# EAGLE design powersystem (EAGLE 8.3.2)
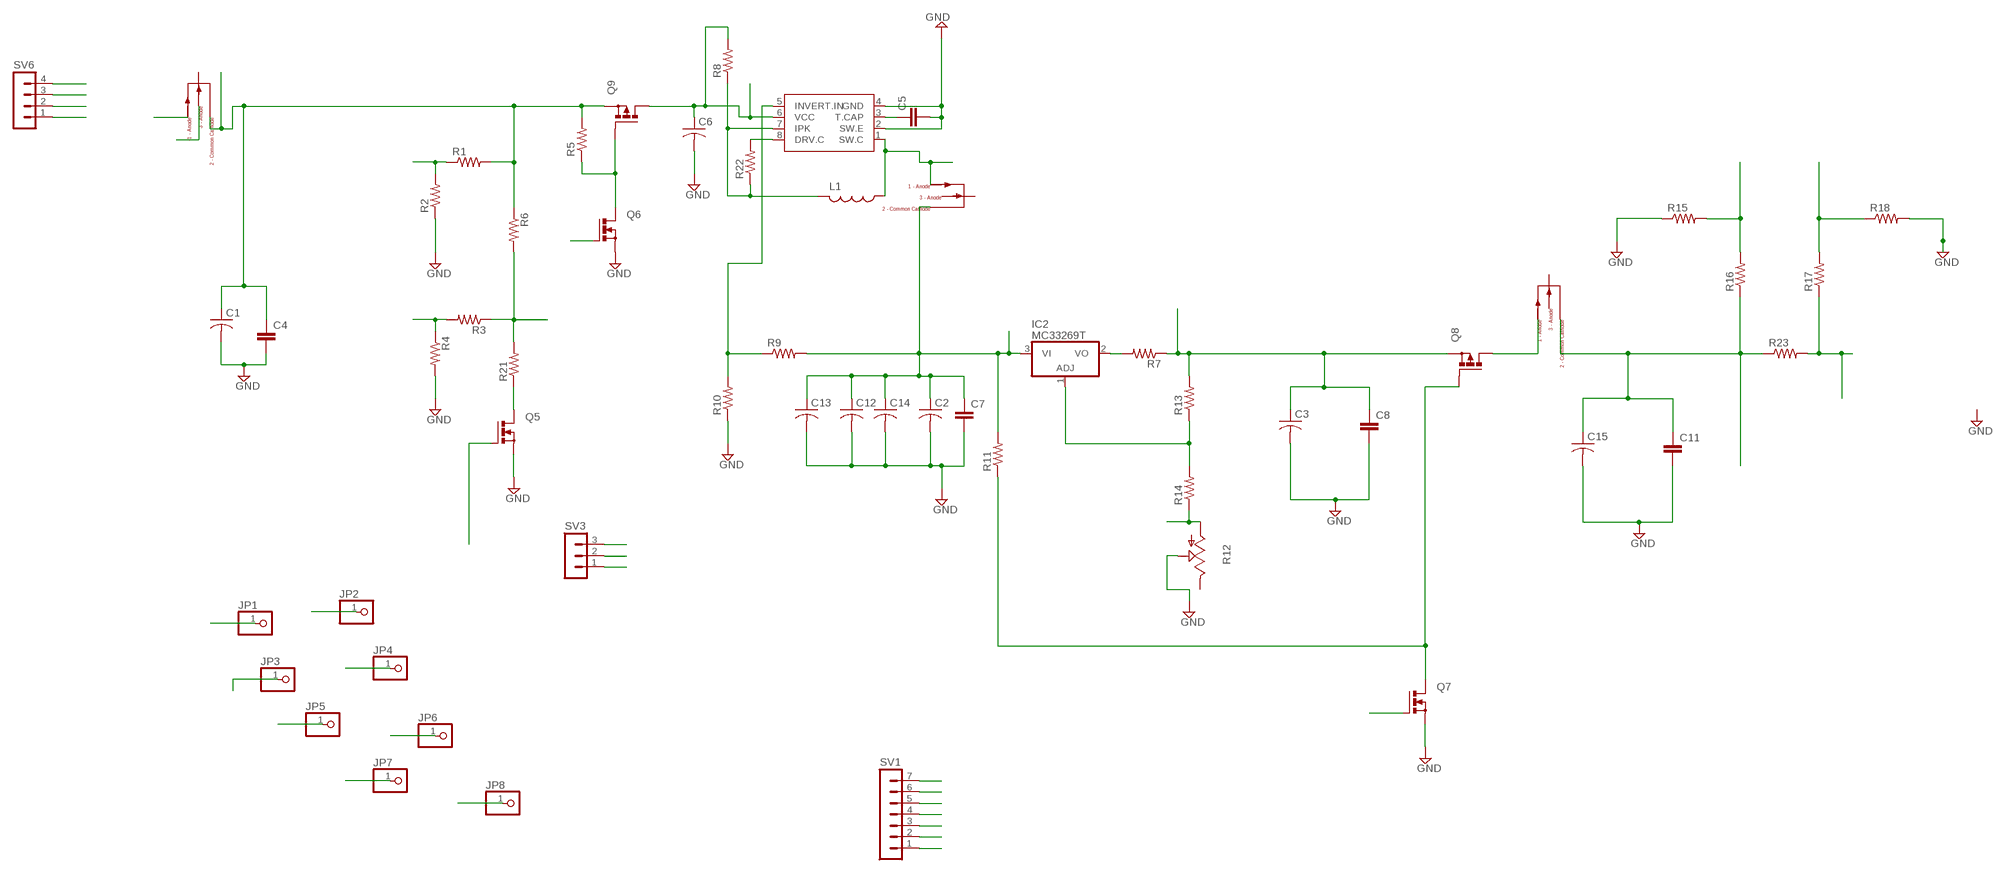
[diagram p0: schematic, sheet 1]

## Parts
C1  C-US025-024X044  [C025-024X044]
C2  C-US025-024X044  [C025-024X044]
C3  C-US025-024X044  [C025-024X044]
C4  C2.5/2  [C2.5-2]
C5  C2.5/2  [C2.5-2]
C6  C-US025-024X044  [C025-024X044]
C7  C2.5/2  [C2.5-2]
C8  C2.5/2  [C2.5-2]
C11  C2.5/2  [C2.5-2]
C12  C-US025-024X044  [C025-024X044]
C13  C-US025-024X044  [C025-024X044]
C14  C-US025-024X044  [C025-024X044]
C15  C-US025-024X044  [C025-024X044]
IC2  MC33269T  [TO220V]
JP1  PINHD-1X1  [1X01]
JP2  PINHD-1X1  [1X01]
JP3  PINHD-1X1  [1X01]
JP4  PINHD-1X1  [1X01]
JP5  PINHD-1X1  [1X01]
JP6  PINHD-1X1  [1X01]
JP7  PINHD-1X1  [1X01]
JP8  PINHD-1X1  [1X01]
L1  L-US0204/5  [0204/5]
Q1  PMOSFET_N  [TO220BV]
Q2  PMOSFET_N  [TO220BV]
Q3  PMOSFET_N  [TO220BV]
Q4  UCC38050  [DIP-8]
Q5  PMOSFET_NTO220BV  [TO220BV]
Q6  PMOSFET_NTO220BV  [TO220BV]
Q7  PMOSFET_NTO220BV  [TO220BV]
Q8  PMOSFET_PTO220BV  [TO220BV]
Q9  PMOSFET_PTO220BV  [TO220BV]
R1  R-US_0204/7  [0204/7]
R2  R-US_0204/7  [0204/7]
R3  R-US_0204/7  [0204/7]
R4  R-US_0204/7  [0204/7]
R5  R-US_0204/7  [0204/7]
R6  R-US_0204/7  [0204/7]
R7  R-US_0207/10  [0207/10]
R8  R-US_0207/10  [0207/10]
R9  R-US_0204/7  [0204/7]
R10  R-US_0204/7  [0204/7]
R11  R-US_0204/7  [0204/7]
R12  TRIM_US-CA6H  [CA6H]
R13  R-US_0204/7  [0204/7]
R14  R-US_0204/7  [0204/7]
R15  R-US_0204/7  [0204/7]
R16  R-US_0204/7  [0204/7]
R17  R-US_0204/7  [0204/7]
R18  R-US_0204/7  [0204/7]
R21  R-US_0204/7  [0204/7]
R22  R-US_0207/10  [0207/10]
R23  R-US_0207/10  [0207/10]
SV1  MA07-1  [MA07-1]
SV3  MA03-1  [MA03-1]
SV6  MA04-1  [MA04-1]

## Nets
BATTERY: JP8.1 R17.1 R23.2 SV1.3
BATTERYLEFT: R15.2 R16.2 SV6.3
BATTERYRIGHT: R17.2 R18.1 SV6.4
BETWEENRESISTOR: JP2.1 R3.1 R6.2 R21.2
DIODE1: C1.1 C4.1 JP1.1 Q1.D Q9.S R1.2 R5.2 R6.1
DUMMYLOADBOTTOM: R3.2 R4.1 SV6.2
DUMMYLOADSWITCH: Q5.G SV3.1
DUMMYLOADTOP: R1.1 R2.2 SV6.1
GND: C1.2 C2.2 C3.2 C4.2 C5.2 C6.2 C7.2 C8.2 C11.2 C12.2 C13.2 C14.2 C15.2 Q4.2(SW.E) Q4.4(GND) Q5.S Q6.S Q7.S R2.1 R4.2 R10.1 R12.S R15.1 R18.2 SV1.5 SV1.6 SV1.7
LOAD: C11.1 C15.1 Q3.D R16.1 R23.1 SV1.4
N$4: Q6.D Q9.G R5.1
N$8: Q4.5(INVERT.IN) R9.1 R10.2
N$10: Q4.8(DRV.C) R22.2
N$11: Q7.D Q8.G R11.1
N$12: IC2.1(ADJ) R13.1 R14.2
N$13: Q3.S Q8.D
N$20: Q5.D R21.1
N$23: IC2.2(VO) R7.2
N$24: L1.2 Q4.7(IPK) R8.1 R22.1
N$26: C5.1 Q4.3(T.CAP)
PINOUT1: JP4.1 L1.1 Q2.S Q4.1(SW.C)
PINOUT6: C6.1 JP3.1 Q4.6(VCC) Q9.D R8.2
POT: JP7.1 R12.A R14.1
PRIMARYNOSUNLIGHT: Q6.G SV3.2
SECONDARYNOSUNLIGHT: Q7.G SV3.3
SOLARPANEL1: Q1.S SV1.1
SOLARPANEL2: Q1.G SV1.2
VINREG: C2.1 C7.1 C12.1 C13.1 C14.1 IC2.3(VI) JP5.1 Q2.D R9.2 R11.2
VOUTREG: C3.1 C8.1 JP6.1 Q8.S R7.1 R13.2
Unconnected: Q2.G Q3.G R12.E

## Library data of the parts
C1-C3 C6 C12-C15 = rcl:C-US: CAPACITOR, American symbol
C4 C5 C7 C8 C11 = capacitor-wima:C: CAPACITOR naming: grid - package width
IC2 = linear:MC33269?*: Adjustable Output Low Dropout Voltage Regulator 800 mA Source: http://www.onsemi.com/pub/Collateral/MC33269-D.PDF
JP1-JP8 = pinhead:PINHD-1X1: PIN HEADER
L1 = resistor:L-US: INDUCTOR, American symbol
Q1-Q3 = sf:PMOSFET_N: Power MOSFET N-Channel
Q4 = sf:UCC38050: TRANSITION MODE PFC CONTROLLER
Q5-Q7 = transistor-power:PMOSFET_N: Power MOSFET N-Channel
Q8 Q9 = transistor-power:PMOSFET_P: Power MOSFET P-Channel
R1-R6 R9-R11 R13-R16 R21 = resistor:R-US_: RESISTOR, American symbol
R7 R8 R17 R18 R22 R23 = rcl:R-US_: RESISTOR, American symbol
R12 = pot:TRIM_US-: POTENTIOMETER
SV1 = con-lstb:MA07-1: PIN HEADER; OC_FARNELL: unknown; OC_NEWARK: unknown
SV3 = con-lstb:MA03-1: PIN HEADER; OC_FARNELL: unknown; OC_NEWARK: unknown
SV6 = con-lstb:MA04-1: PIN HEADER; OC_FARNELL: unknown; OC_NEWARK: unknown

## Board
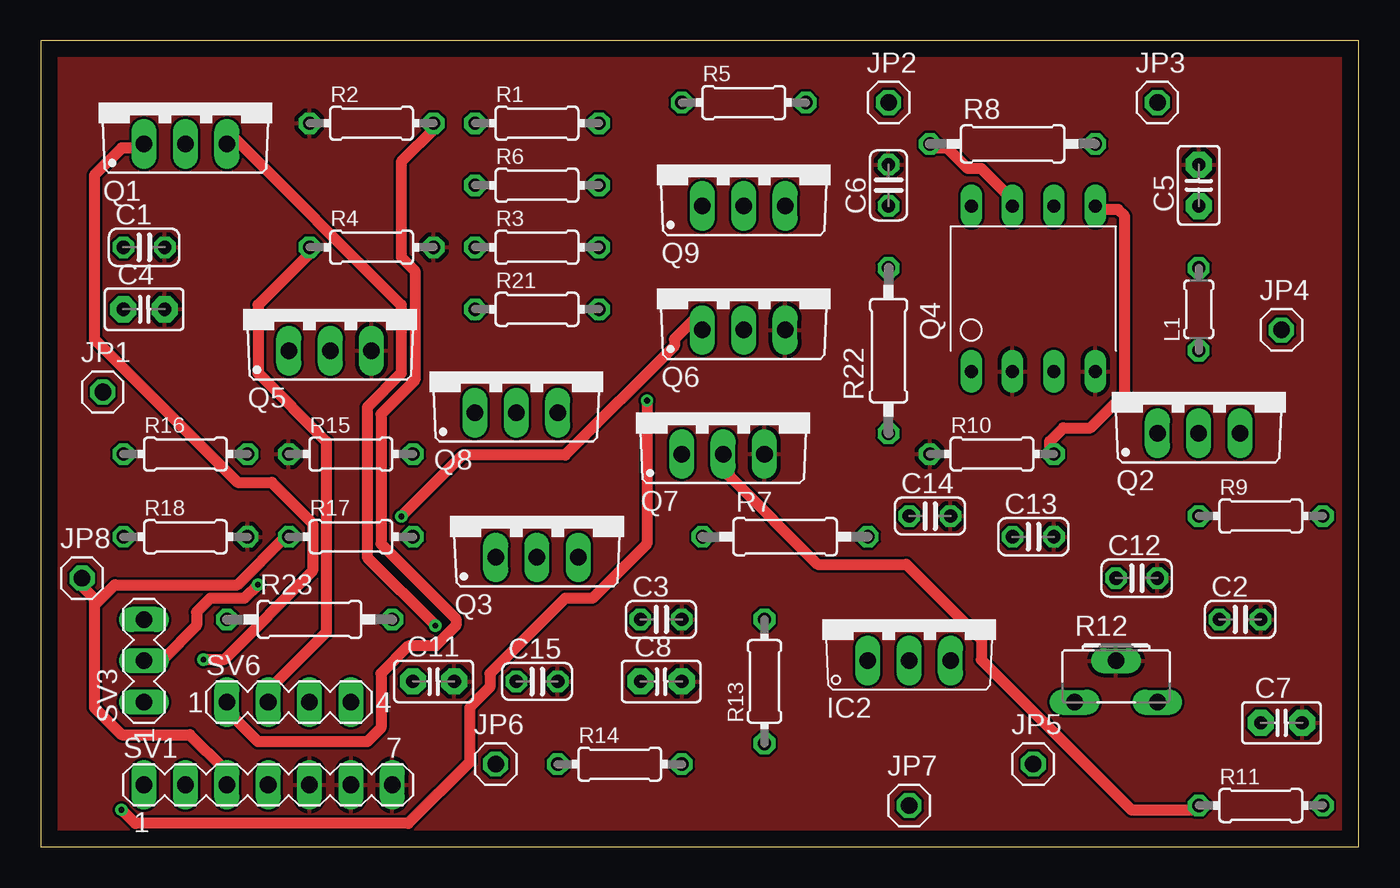
[diagram p1: board, top side]
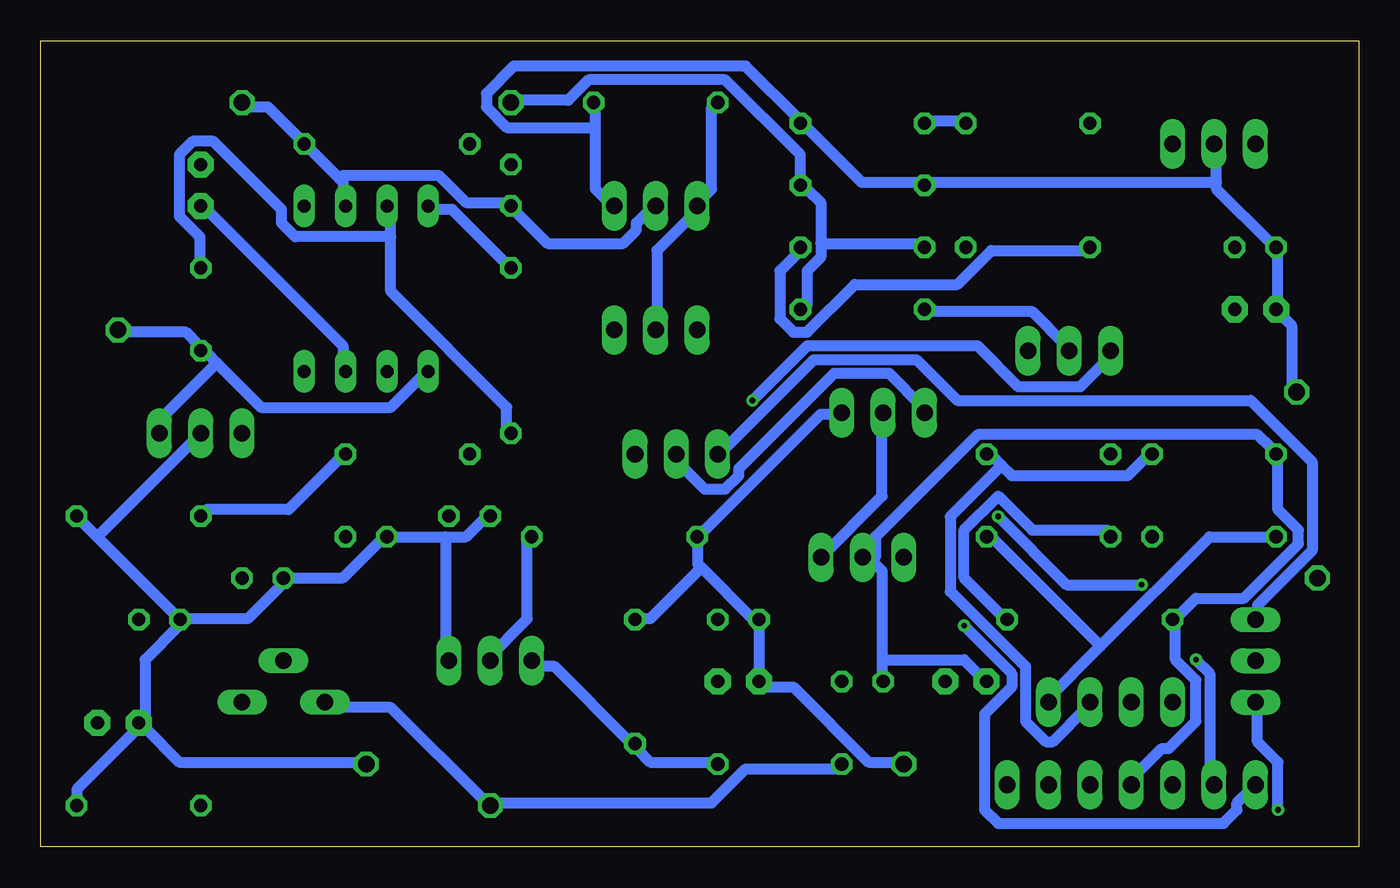
[diagram p2: board, bottom side, seen from below]

Size 80.95 x 49.52 mm. Coordinates in mm from the lower left corner, seen from the top.
Outline: 0,0 80.95,0 80.95,49.52 0,49.52 0,0
Copper layers (1*16): Top 0.035mm / dielectric 1.5mm / Bottom 0.035mm
Design rules "default *": minimum track width 27mil, minimum drill 0.35mm, track to track 6mil, track to pad 6mil, pad to pad 6mil, via to via 6mil, smd to smd 6mil, copper to edge 40mil, drill to drill 6mil, minimum pad ring 10mil, minimum via ring 8mil, stop-mask expansion 4mil, vias tented up to drill 0mil, thermal gap 10mil

### Footprints (pad centres in the part's own frame; a part is rotated, then mirrored left to right if it is on the bottom)
C025-024X044 = drill 0.813 octagon: 1 -1.27,0; 2 1.27,0
C2.5-2 = drill 0.813 pad 1.6 octagon: 1 -1.27,0; 2 1.27,0
TO220V = drill 1.016 long: 1 -2.54,-2.54; 2 0,-2.54; 3 2.54,-2.54
1X01 = drill 1.016 octagon: 1 0,0
0204/5 = drill 0.813 octagon: 1 -2.54,0; 2 2.54,0
TO220BV = drill 1.016 long: D 0,-2.54; G -2.54,-2.54; S 2.54,-2.54
DIP-8 = drill 0.8 long: 1 -2.54,-5.08; 2 0,-5.08; 3 2.54,-5.08; 4 5.08,-5.08; 5 5.08,5.08; 6 2.54,5.08; 7 0,5.08; 8 -2.54,5.08
0204/7 = drill 0.813 octagon: 1 -3.81,0; 2 3.81,0
0207/10 = drill 0.813 octagon: 1 -5.08,0; 2 5.08,0
CA6H = drill 1.016 long: A -2.54,0; E 2.54,0; S 0,2.54
MA07-1 = drill 1.016 long: 1 -7.62,0; 2 -5.08,0; 3 -2.54,0; 4 0,0; 5 2.54,0; 6 5.08,0; 7 7.62,0
MA03-1 = drill 1.016 long: 1 -2.54,0; 2 0,0; 3 2.54,0
MA04-1 = drill 1.016 long: 1 -3.81,0; 2 -1.27,0; 3 1.27,0; 4 3.81,0

### Placement (x,y rotation side)
C1  6.35,36.83 0 top
C2  73.66,13.97 0 top
C3  38.1,13.97 0 top
C4  6.35,33.02 0 top
C5  71.12,40.64 90 top
C6  52.07,40.64 90 top
C7  76.2,7.62 0 top
C8  38.1,10.16 0 top
C11  24.13,10.16 0 top
C12  67.31,16.51 0 top
C13  60.96,19.05 0 top
C14  54.61,20.32 0 top
C15  30.48,10.16 0 top
IC2  53.34,13.97 0 top
JP1  3.81,27.94 0 top
JP2  52.07,45.72 0 top
JP3  68.58,45.72 0 top
JP4  76.2,31.75 0 top
JP5  60.96,5.08 0 top
JP6  27.94,5.08 0 top
JP7  53.34,2.54 0 top
JP8  2.54,16.51 0 top
L1  71.12,33.02 90 top
Q1  8.89,45.72 0 top
Q2  71.12,27.94 0 top
Q3  30.48,20.32 0 top
Q4  59.69,34.29 0 top
Q5  17.78,33.02 0 top
Q6  43.18,34.29 0 top
Q7  41.91,26.67 0 top
Q8  29.21,29.21 0 top
Q9  43.18,41.91 0 top
R1  30.48,44.45 0 top
R2  20.32,44.45 0 top
R3  30.48,36.83 0 top
R4  20.32,36.83 0 top
R5  43.18,45.72 0 top
R6  30.48,40.64 0 top
R7  45.72,19.05 0 top
R8  59.69,43.18 0 top
R9  74.93,20.32 0 top
R10  58.42,24.13 0 top
R11  74.93,2.54 0 top
R12  66.04,8.89 0 top
R13  44.45,10.16 90 top
R14  35.56,5.08 0 top
R15  19.05,24.13 0 top
R16  8.89,24.13 0 top
R17  19.05,19.05 0 top
R18  8.89,19.05 0 top
R21  30.48,33.02 0 top
R22  52.07,30.48 90 top
R23  16.51,13.97 0 top
SV1  13.97,3.81 0 top
SV3  6.35,11.43 90 top
SV6  15.24,8.89 0 top

### Tracks (layer width: path | path; a pad name or v marks a point on that pad's centre or on a via)
BATTERY
  Top 0.686: 3.29,14.85 3.29,15.27 2.45,16.1 JP8.1 | 3.29,14.85 3.29,8.56 4.97,6.88 9.16,6.88 11.25,4.79 11.25,3.95 SV1.3 | 3.29,14.85 4.55,16.1 12.09,16.1 15.02,19.04 R17.1
  Bottom 0.686: R17.1 15.44,19.46 20.05,19.46 22.15,21.55 24.24,19.46 24.24,16.52 21.73,14.01 R23.2
BATTERYLEFT
  Bottom 0.686: 21.94,23.44 22.57,24.07 R15.2 | 21.94,23.44 21.31,22.81 14.19,22.81 12.93,24.07 R16.2 | 21.94,23.44 25.08,20.29 25.08,15.68 20.47,11.07 20.47,7.72 19.22,6.46 18.8,6.46 16.7,8.56 SV6.3
BATTERYRIGHT
  Bottom 0.686: 15.86,12.33 19.22,8.98 SV6.4 | 15.86,12.33 9.16,19.04 5.38,19.04 R18.1 | 15.86,12.33 22.57,19.04 R17.2
BETWEENRESISTOR
  Bottom 0.686: 33.05,37.06 33.05,39.57 33.88,40.41 R6.2 34.3,40.83 34.3,42.51 38.91,47.12 47.3,47.12 48.55,45.86 51.91,45.86 JP2.1 | 33.05,37.06 33.05,36.22 33.88,35.38 33.88,33.29 R21.2 | 33.05,37.06 26.76,37.06 R3.1
DIODE1
  Bottom 0.686: JP1.1 4.13,28.26 4.13,32.03 4.97,32.87 C4.1 4.97,33.29 4.97,36.64 C1.1 5.38,37.06 8.74,40.41 8.74,40.83 | 8.74,40.83 8.74,42.93 Q1.D | 46.88,44.18 46.88,40.41 46.04,39.57 Q9.S | 46.88,44.18 46.88,45.44 R5.2 | 46.88,44.18 52.32,44.18 53.58,45.44 53.58,46.28 51.91,47.95 37.66,47.95 34.3,44.6 R1.2 33.88,44.18 30.53,40.83 26.76,40.83 R6.1 26.34,40.83 8.74,40.83
DUMMYLOADBOTTOM
  Top 0.686: SV6.2 14.19,8.98 14.19,9.82 17.54,13.17 17.54,24.9 13.35,29.1 13.35,33.29 16.7,36.64 R4.1
  Bottom 0.686: R4.1 16.7,36.64 22.57,36.64 24.66,34.54 30.95,34.54 33.88,31.61 34.72,31.61 35.56,32.45 35.56,35.38 34.3,36.64 R3.2
DUMMYLOADSWITCH  (via drill 0.35)
  Top 0.686: v4.97,2.27 5.8,1.44 22.57,1.44 26.34,5.21 26.34,8.56 27.6,9.82 27.6,10.65 32.21,15.27 33.88,15.27 37.24,18.62 v37.24,27.42
  Bottom 0.686: v4.97,2.27 4.97,5.21 6.22,6.46 6.22,8.56 SV3.1 | v37.24,27.42 33.88,30.77 23.41,30.77 20.89,28.26 17.12,28.26 15.02,30.35 Q5.G
DUMMYLOADTOP
  Top 0.686: SV6.1 11.67,8.56 11.67,8.14 13.35,6.46 20.05,6.46 20.89,7.3 20.89,10.65 22.57,12.33 24.24,12.33 25.5,13.59 25.5,14.01 20.89,18.62 20.89,26.58 22.99,28.68 22.99,35.38 22.15,36.22 22.15,42.09 24.24,44.18 R2.2
  Bottom 0.686: R2.2 24.24,44.6 26.34,44.6 R1.1
GND
  pour Top: 0,49.53 81.28,49.53 81.28,0 0,0
LOAD
  Bottom 0.686: 29.27,11.49 29.27,16.94 29.9,17.57 | 29.27,11.49 29.27,10.24 C15.1 | 29.9,17.57 30.11,17.78 Q3.D | 29.27,11.49 24.24,11.49 22.99,10.24 C11.1 | SV1.4 14.19,3.95 12.09,6.05 11.67,6.05 9.99,7.72 9.99,10.24 11.25,11.49 11.25,13.59 R23.1 11.25,14.01 9.99,15.27 7.06,15.27 3.71,18.62 3.71,19.46 4.97,20.71 4.97,24.07 R16.1 5.38,24.49 6.22,25.32 23.41,25.32 29.69,19.04 29.69,17.78 29.9,17.57
N$4
  Bottom 0.686: R5.1 39.75,45.44 39.75,40.41 40.59,39.57 Q9.G 40.59,39.15 43.1,36.64 43.1,32.03 Q6.D
N$8
  Top 0.686: Q4.5 64.9,39.15 66.15,39.15 66.57,38.73 66.57,27.84 64.48,25.74 62.8,25.74 61.96,24.9 61.96,24.49 R10.2
  Bottom 0.686: R9.1 70.76,20.71 65.73,20.71 62.38,24.07 R10.2
N$10
  Bottom 0.686: Q4.8 56.93,39.15 55.68,39.15 52.32,35.8 R22.2
N$11
  Top 0.686: R11.1 70.76,2.27 66.99,2.27 57.77,11.49 57.77,12.75 53.16,17.36 47.71,17.36 42.27,22.81 42.27,24.07 Q7.D
  Bottom 0.686: Q8.G 26.76,27 28.85,29.1 32.21,29.1 38.07,23.23 38.07,22.81 38.91,21.97 40.17,21.97 42.27,24.07 Q7.D
N$12
  Bottom 0.686: R14.2 39.75,5.21 43.52,5.21 44.36,6.05 R13.1 44.78,6.46 49.39,11.07 50.65,11.07 IC2.1
N$13
  Bottom 0.686: Q8.D 29.27,26.58 29.27,21.55 33.05,17.78 Q3.S
N$20
  Bottom 0.686: R21.1 26.34,32.87 20.05,32.87 17.96,30.77 Q5.D
N$23
  Bottom 0.686: R7.2 51.07,19.04 51.07,14.01 53.58,11.49 IC2.2
N$24
  Top 0.686: R8.1 54.84,42.93 55.68,42.93 56.93,41.67 57.77,41.67 59.87,39.57 Q4.7
  Bottom 0.686: 59.45,37.48 59.45,34.12 52.32,27 52.32,25.74 R22.1 | 59.45,37.48 59.45,39.15 Q4.7 | 59.45,37.48 65.32,37.48 66.15,38.32 66.15,39.15 70.34,43.34 71.6,43.34 72.44,42.51 72.44,38.73 71.18,37.48 71.18,35.8 L1.2
N$26
  Bottom 0.686: Q4.3 62.38,29.52 62.38,30.77 70.76,39.15 C5.1
PINOUT1
  Bottom 0.686: 70.14,29.72 70.76,30.35 L1.1 71.18,30.77 72.02,31.61 75.79,31.61 JP4.1 | 70.14,29.72 67.41,27 59.45,27 57.35,29.1 Q4.1 | 70.14,29.72 73.28,26.58 73.28,25.74 Q2.S
PINOUT6
  Bottom 0.686: 62.59,41.04 64.48,42.93 R8.2 64.9,43.34 66.99,45.44 68.25,45.44 JP3.1 | 62.59,41.04 62.38,40.83 62.38,39.57 Q4.6 | 62.59,41.04 62.38,41.25 56.52,41.25 54.84,39.57 52.32,39.57 C6.1 51.91,39.15 49.81,37.06 45.2,37.06 44.36,37.9 44.36,38.32 43.52,39.15 Q9.D
POT
  Bottom 0.686: R14.1 31.79,4.79 37.66,4.79 39.75,2.69 53.16,2.69 JP7.1 53.58,2.69 59.45,8.56 63.22,8.56 R12.A
PRIMARYNOSUNLIGHT  (via drill 0.35)
  Top 0.686: v13.35,16.1 12.51,15.27 10.41,15.27 9.58,14.43 9.58,13.59 7.48,11.49 6.64,11.49 SV3.2 | v22.15,20.29 25.92,24.07 32.21,24.07 38.91,30.77 38.91,31.19 40.17,32.45 40.59,32.45 41.01,32.03 Q6.G
  Bottom 0.686: v13.35,16.1 17.96,16.1 v22.15,20.29
SECONDARYNOSUNLIGHT
  Bottom 0.686: SV3.3 6.22,14.01 6.22,14.85 2.87,18.2 2.87,23.65 6.64,27.42 24.66,27.42 27.18,29.93 33.46,29.93 39.33,24.07 Q7.G
SOLARPANEL1  (via drill 0.35)
  Top 0.686: v24.24,13.59 20.05,17.78 20.05,27 22.15,29.1 22.15,33.29 11.67,43.76 11.25,43.34 Q1.S
  Bottom 0.686: v24.24,13.59 21.31,10.65 21.31,9.82 22.99,8.14 22.99,2.27 22.15,1.44 8.32,1.44 7.48,2.27 7.48,2.69 6.64,3.53 SV1.1
SOLARPANEL2  (via drill 0.35)
  Top 0.686: v9.99,11.49 11.25,11.49 16.7,16.94 16.7,19.88 14.19,22.39 12.09,22.39 3.29,31.19 3.29,41.25 4.97,42.93 6.22,42.93 Q1.G
  Bottom 0.686: v9.99,11.49 9.16,10.65 9.16,3.95 SV1.2
VINREG
  Bottom 0.686: R11.2 78.73,2.69 78.73,3.53 74.96,7.3 C7.1 | JP5.1 61.12,5.21 72.44,5.21 74.54,7.3 C7.1 | 56.1,19.04 59.45,19.04 C13.1 59.87,19.04 62.38,16.52 65.73,16.52 C12.1 66.15,16.1 68.25,14.01 72.02,14.01 C2.1 | 56.1,19.04 54.84,19.04 53.58,20.29 C14.1 | 56.1,19.04 56.1,11.49 IC2.3 | 77.47,19.04 72.44,14.01 C2.1 | 77.47,19.04 78.73,20.29 R9.2 | 77.47,19.04 71.18,25.32 Q2.D | C7.1 74.54,7.72 74.54,11.49 72.44,13.59 C2.1
VOUTREG
  Bottom 0.686: 40.59,19.04 40.59,17.36 40.38,17.15 | 40.38,17.15 37.24,14.01 C3.1 36.82,13.59 36.82,10.24 C8.1 36.82,9.82 34.72,9.82 30.11,5.21 28.02,5.21 JP6.1 | 40.38,17.15 43.52,14.01 44.36,14.01 R13.2 | 40.59,19.04 33.05,26.58 31.79,26.58 Q8.S | 40.59,19.04 R7.1